# Altium schematic sheet power.SchDoc
size Letter
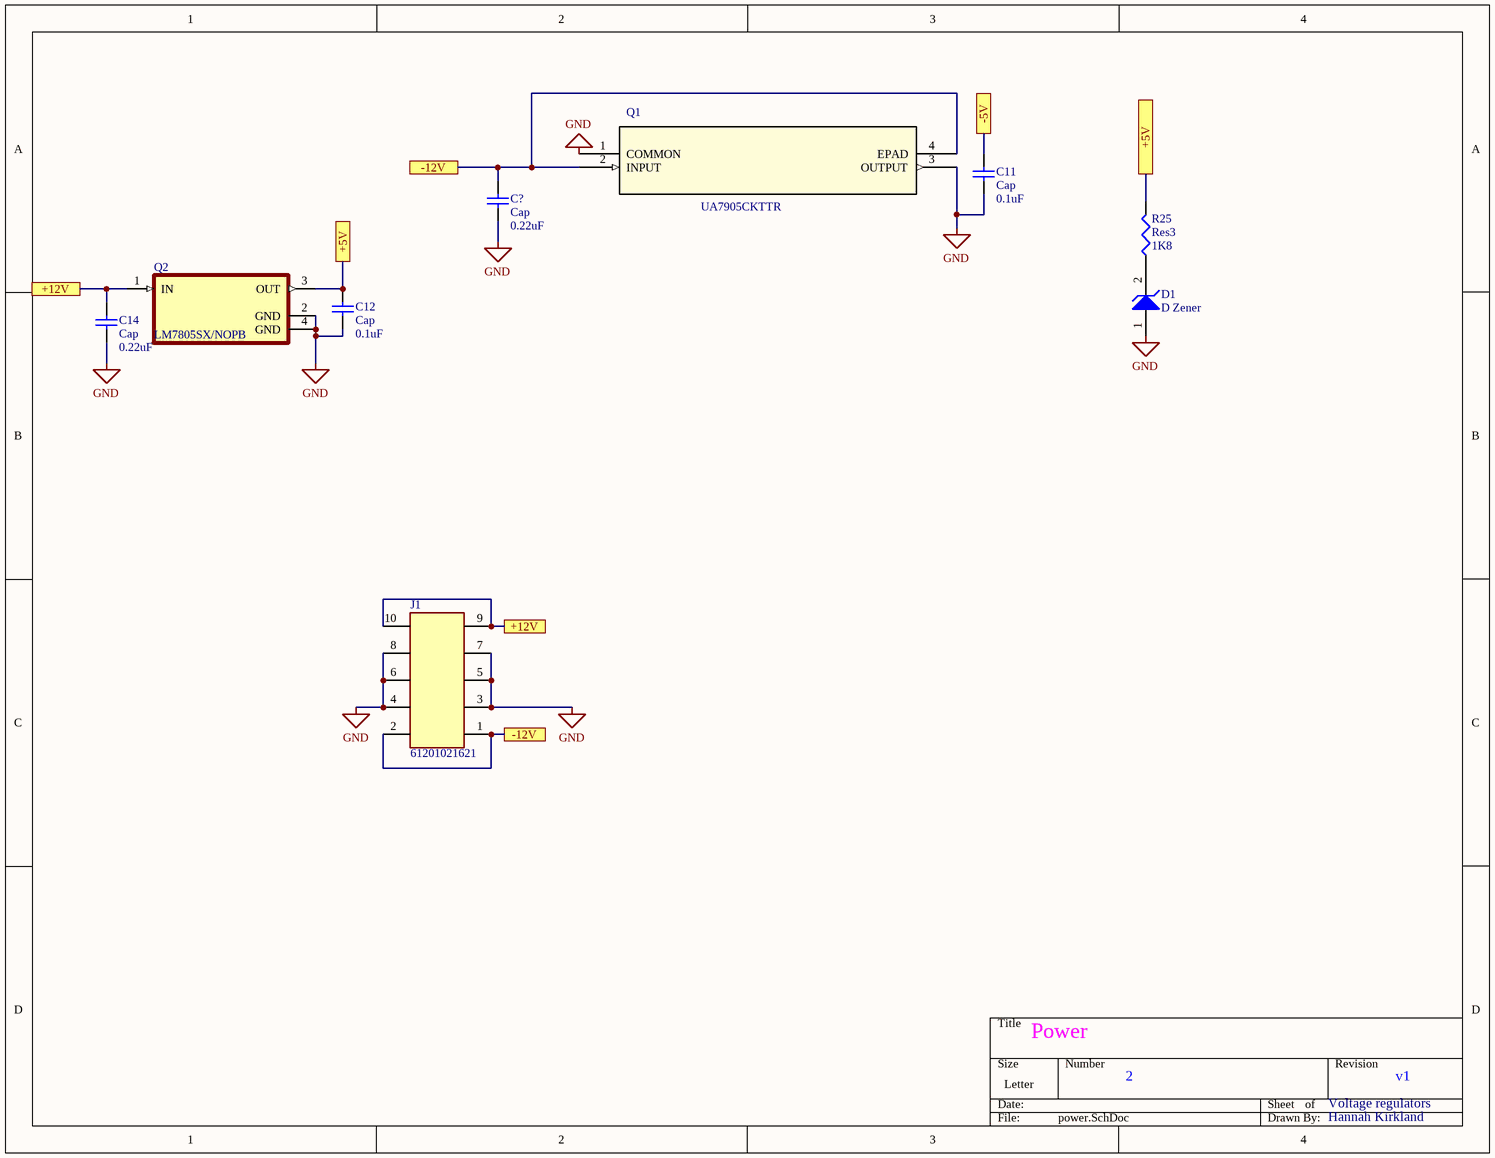
[diagram p0: power.SchDoc]

## Parts
C11  Cap  value 0.1uF  [C1206]
C12  Cap  value 0.1uF  [C1206]
C14  Cap  value 0.22uF  [C1206]
C?  Cap  value 0.22uF  [C1206]
D1  D Zener  [SOT23_N]
J1  61201021621  [61201021621]
Q1  UA7905CKTTR  [TO254P1524X483-4N]
Q2  LM7805SX/NOPB  [TO254P1524X483-4N]
R25  Res3  value 1K8  [C1206]

## Ports
+5V, +12V, -5V, -12V

## Nets
GND: C11.1 C12.1 C14.1 C?.1 D1.1(A) J1.3 J1.4 J1.5 J1.6 J1.7 J1.8 Q1.1(COMMON) Q1.3(OUTPUT) Q2.2(GND) Q2.4(GND)
+5V: C12.2 Q2.3(OUT) R25.2 ; port +5V
+12V: C14.2 J1.9 J1.10 Q2.1(IN) ; port +12V
-5V: C11.2 ; port -5V
-12V: C?.2 J1.1 J1.2 Q1.2(INPUT) Q1.4(EPAD) ; port -12V
NetD1_2: D1.2(K) R25.1

## Notes on the sheet
- Power
- 2
- Voltage regulators
- v1
- Hannah Kirkland

## Library data of the parts
C11 C12 C14 C? = Cap: Capacitor; Published: 8-Jun-2000; LatestRevisionDate: 17-Jul-2002; LatestRevisionNote: Re-released for DXP Platform.; PackageReference: RAD-0.3; Publisher: Altium Limited; PackageDescription: Radial Cap, Thru-Hole; 2 Leads; 0.3 in Pin Spacing
D1 = D Zener: Zener Diode; pin to pad: 1>2 2>3; Published: 8-Jun-2000; LatestRevisionDate: 17-Jul-2002; LatestRevisionNote: Re-released for DXP Platform.; PackageReference: DIODE-0.7; Publisher: Altium Limited; PackageDescription: Diode, Thru-Hole; 2 Leads; 0.7 in Pin Spacing
J1 = 61201021621: Connector Header Through Hole 10 position 0.100 _2.54mm_; MF: Wurth Electronics; Price: None; Package: None; Value: *; MP: 61201021621; Availability: Unavailable; SnapEDA_Link: https://www.snapeda.com/parts/61201021621/Wurth%20Electronics%20Inc./view-part/1156232/?ref=snap
Q1 = UA7905CKTTR: No Description Available; Mfr_Name: Texas Instruments; Type: DEV; Copyright: Copyright (C) 2022 Ultra Librarian. All rights reserved.; Manufacturer_Part_Number: UA7905CKTTR; Digi-Key_Part_Number_1: 296-20799-1-ND; Digi-Key_Part_Number_2: 296-20799-2-ND; Digi-Key_Part_Number_3: 296-20799-6-ND; Digi-Key_Part_Number_4: 2156-UA7905CKTTR-ND; RefDes: RefDes
Q2 = LM7805SX/NOPB: 1.5-A, 30-V, linear voltage regulator 3-DDPAK/TO-263 0 to 125; MF: Texas Instruments; Package: TO-263-3 Texas Instruments; Texas_Instruments-Purchase-URL: https://snapeda.com/shop?store=Texas+Instruments&id=545072; Value: *; Price: None; MP: LM7805SX/NOPB; Availability: Warning; SnapEDA_Link: https://www.snapeda.com/parts/LM7805SX/NOPB/Texas%20Instruments/view-part/545072/?ref=snap; DigiKey-Purchase-URL: https://snapeda.com/shop?store=DigiKey&id=545072; Mouser-Purchase-URL: https://snapeda.com/shop?store=Mouser&id=545072; BuyPart: https://www.snapeda.com/parts/LM7805SX/NOPB/Texas%20Instruments/view-part/545072/?ref=eda
R25 = Res3: Resistor; Published: 8-Jun-2000; LatestRevisionDate: 29-May-2009; LatestRevisionNote: IPC-7351 Footprint Added.; PackageReference: J1-0603; Publisher: Altium Limited; PackageDescription: Chip Resistor